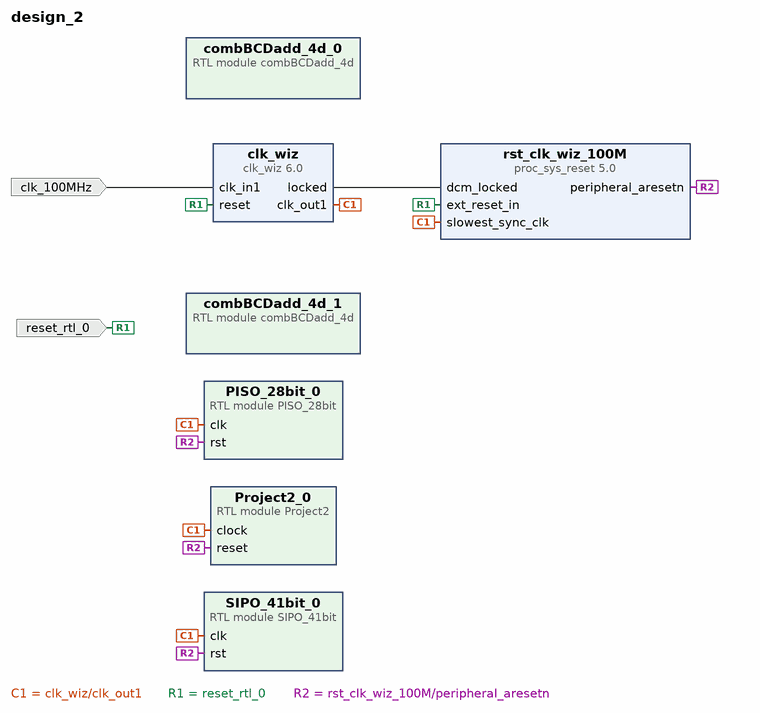
[diagram p0: block diagram of the top level]
# Vivado block design design_2, xc7s6ftgb196-1, Vivado 2024.1
create_bd_design design_2

create_bd_port -dir I -type clk clk_100MHz
set_property -dict {CONFIG.FREQ_HZ 100000000} [get_bd_ports clk_100MHz]
create_bd_port -dir I -type rst reset_rtl_0
set_property -dict {CONFIG.POLARITY ACTIVE_HIGH} [get_bd_ports reset_rtl_0]

create_bd_cell -type module -reference Project2 Project2_0
create_bd_cell -type ip -vlnv xilinx.com:ip:clk_wiz:6.0 clk_wiz
set_property -dict {CONFIG.CLKOUT1_REQUESTED_OUT_FREQ 100} [get_bd_cells clk_wiz]
create_bd_cell -type ip -vlnv xilinx.com:ip:proc_sys_reset:5.0 rst_clk_wiz_100M
create_bd_cell -type module -reference SIPO_41bit SIPO_41bit_0
create_bd_cell -type module -reference PISO_28bit PISO_28bit_0
create_bd_cell -type module -reference combBCDadd_4d combBCDadd_4d_0
create_bd_cell -type module -reference combBCDadd_4d combBCDadd_4d_1

# ---- connections ----

connect_bd_net [get_bd_ports clk_100MHz] [get_bd_pins clk_wiz/clk_in1]
connect_bd_net [get_bd_pins clk_wiz/clk_out1] \
  [get_bd_pins Project2_0/clock] [get_bd_pins rst_clk_wiz_100M/slowest_sync_clk] [get_bd_pins SIPO_41bit_0/clk] \
  [get_bd_pins PISO_28bit_0/clk]
connect_bd_net [get_bd_pins clk_wiz/locked] [get_bd_pins rst_clk_wiz_100M/dcm_locked]
connect_bd_net -net reset_rtl_0_1 [get_bd_ports reset_rtl_0] [get_bd_pins clk_wiz/reset] [get_bd_pins rst_clk_wiz_100M/ext_reset_in]
connect_bd_net [get_bd_pins rst_clk_wiz_100M/peripheral_aresetn] \
  [get_bd_pins Project2_0/reset] [get_bd_pins SIPO_41bit_0/rst] [get_bd_pins PISO_28bit_0/rst]

validate_bd_design
save_bd_design
